# Altium schematic sheet Micromouse.SchDoc
size 594 x 420 mm; SheetNumber: 1; SheetTotal: 1
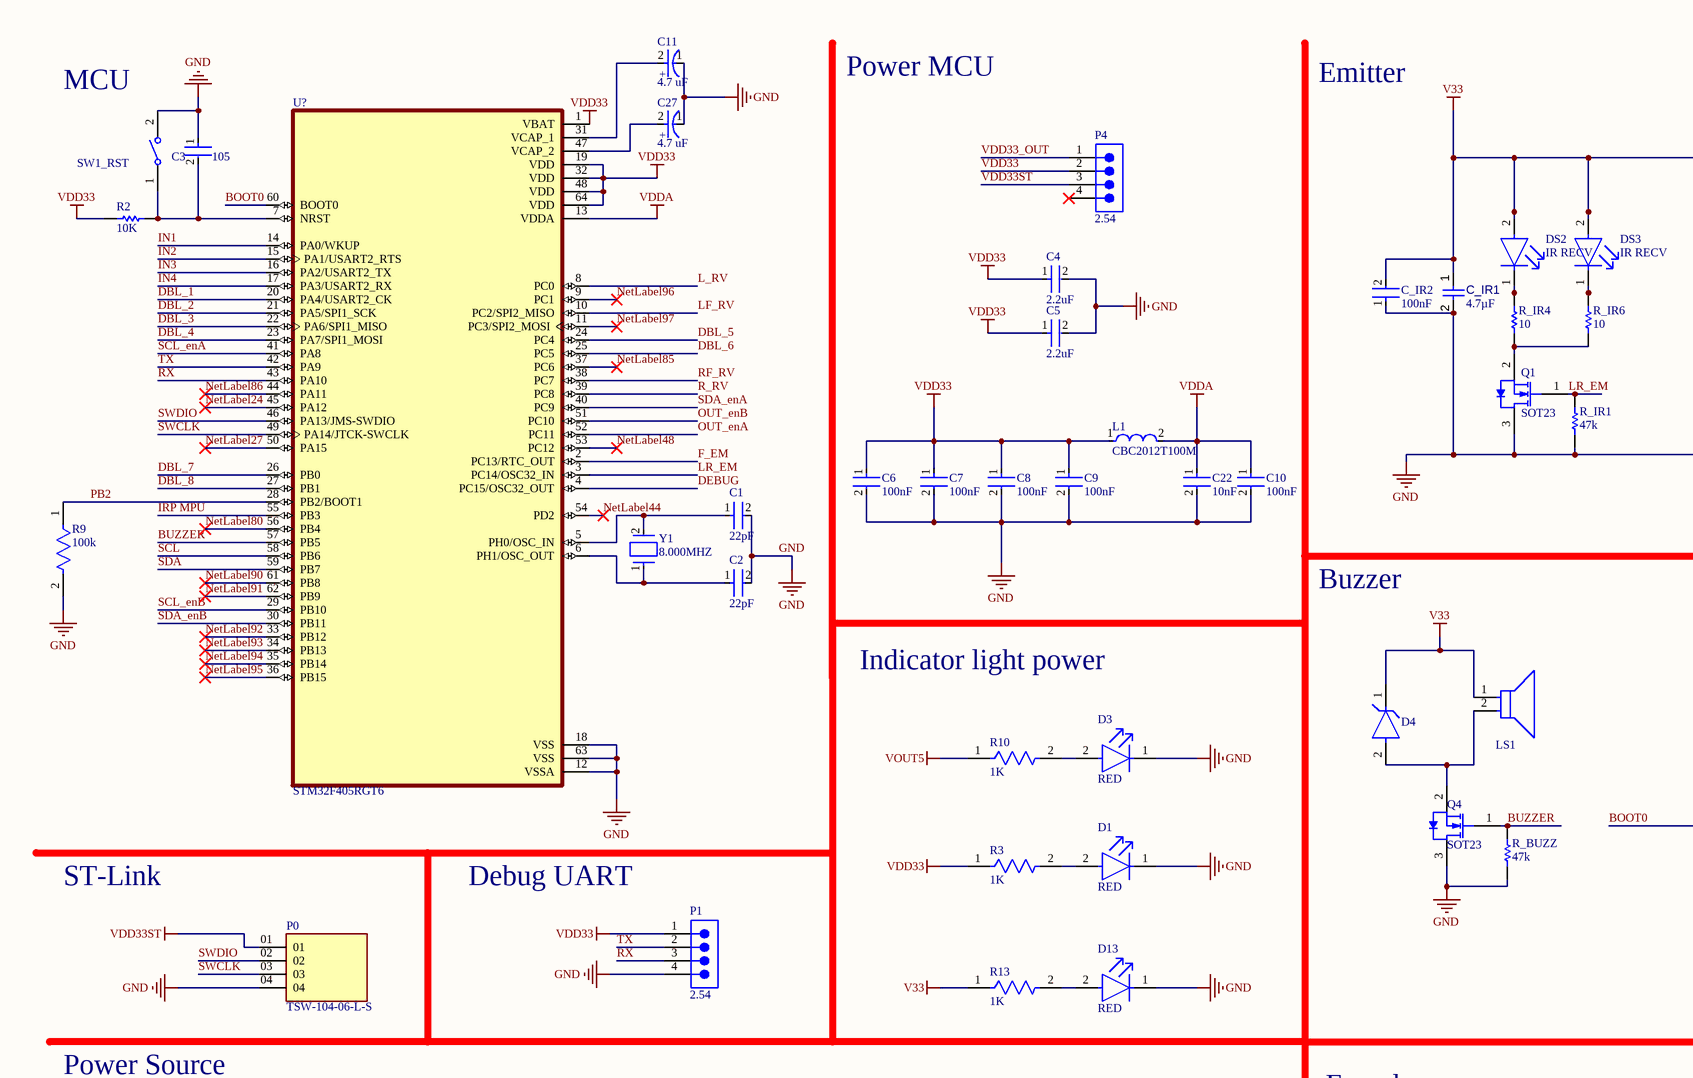
[diagram p0: Micromouse.SchDoc, top left]
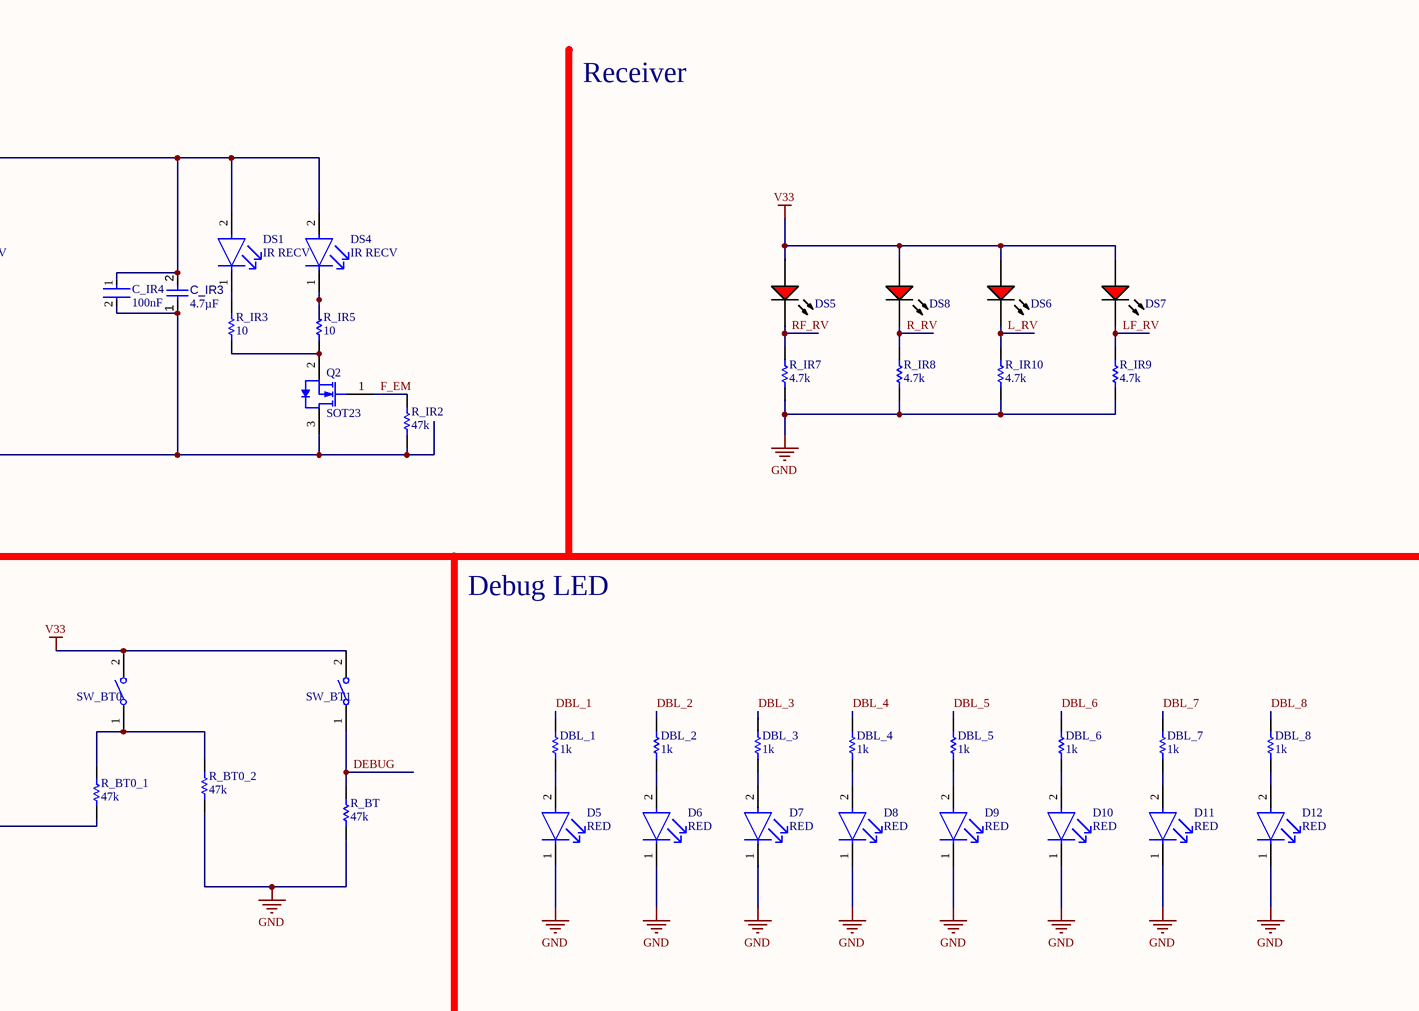
[diagram p1: Micromouse.SchDoc, top right]
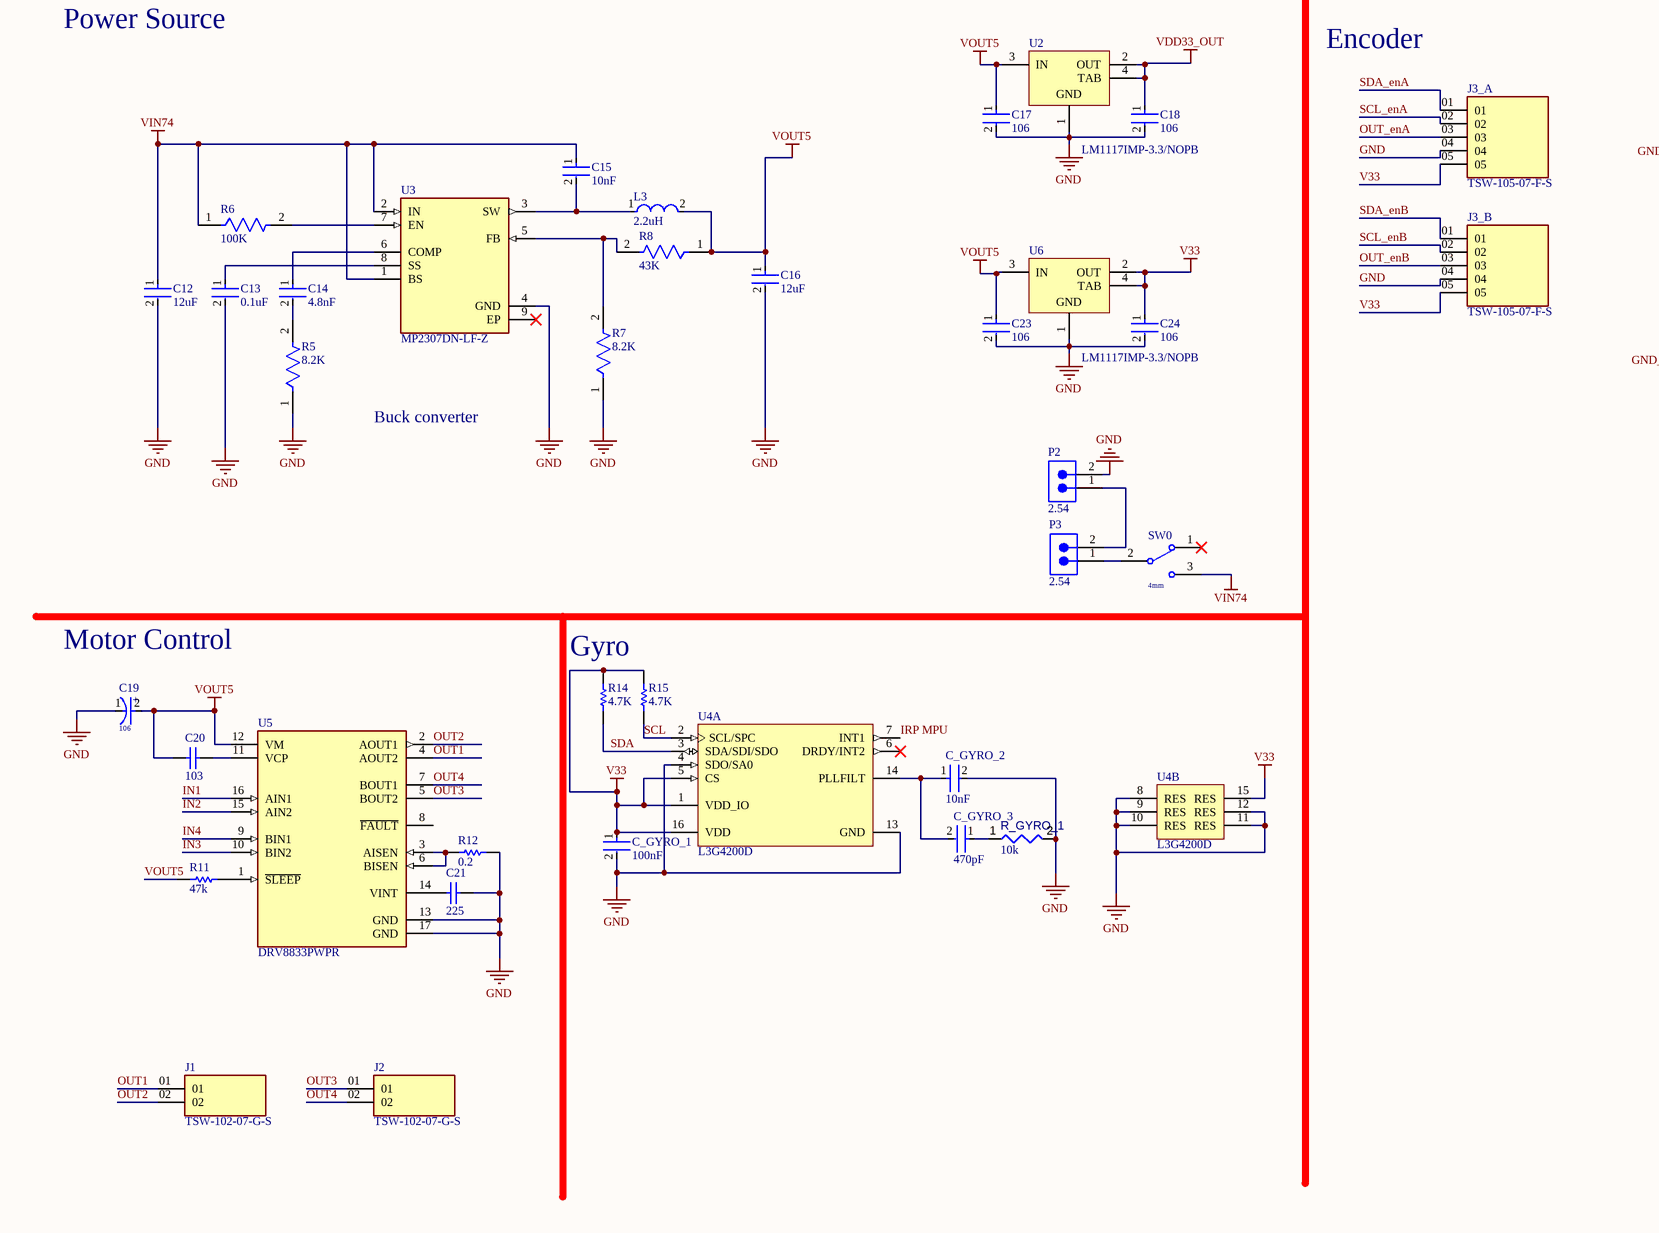
[diagram p2: Micromouse.SchDoc, bottom left]
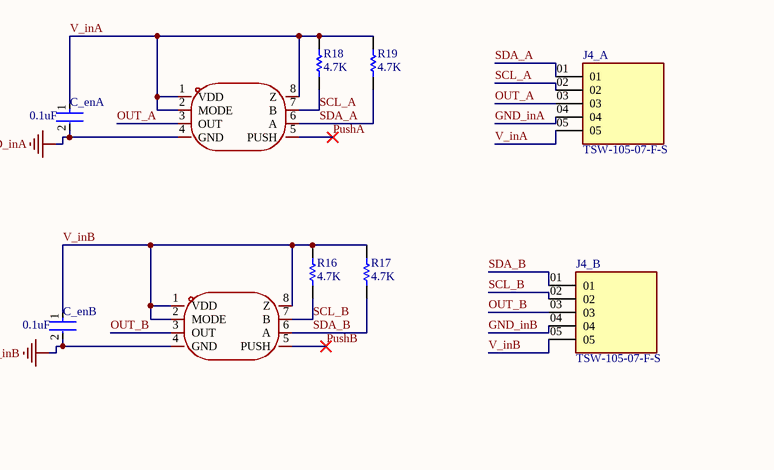
[diagram p3: Micromouse.SchDoc, bottom right]

## Parts
C1  22pF  [FP-CL32-IPC_B]
C2  22pF  [FP-CL32-IPC_B]
C3  105  [FP-CL21-IPC_B]
C4  2.2uF  [FP-CL21-IPC_B]
C5  2.2uF  [FP-CL21-IPC_B]
C6  100nF  [FP-CL10-IPC_C]
C7  100nF  [FP-CL10-IPC_C]
C8  100nF  [FP-CL10-IPC_C]
C9  100nF  [FP-CL10-IPC_C]
C10  100nF  [FP-CL10-IPC_C]
C11  4.7 uF  [FP-TAJA-MFG]
C12  12uF  [FP-C1206C-EB-MFG]
C13  0.1uF  [FP-C1206C-EB-MFG]
C14  4.8nF  [FP-C1206C-EB-MFG]
C15  10nF  [FP-C1206C-EB-MFG]
C16  12uF  [FP-C1206C-EB-MFG]
C17  106  [FP-GRT31C-0_2-IPC_A]
C18  106  [FP-GRT31C-0_2-IPC_A]
C19  106  [FP-T491C-MFG]
C20  103  [CAPC2013X88X50LL20T25]
C21  225  [CAPC3216X180X50LL20T25]
C22  10nF  [FP-CL10-IPC_C]
C23  106  [FP-GRT31C-0_2-IPC_A]
C24  106  [FP-GRT31C-0_2-IPC_A]
C27  4.7 uF  [FP-TAJA-MFG]
C_enA  0.1uF  [FP-C1206C-EB-MFG]
C_enB  0.1uF  [FP-C1206C-EB-MFG]
C_GYRO_1  100nF  [FP-CL10-IPC_C]
C_GYRO_2  10nF  [FP-C0805C-DN-MFG]
C_GYRO_3  470pF  [FP-C0805C-DN-MFG]
C_IR1  value 4.7µF  [CAPC0805(2012)145_L]  (hidden comment: Capacitor 4.7µF +/-40% 25V 0805)
C_IR2  100nF  [FP-CL10-IPC_C]
C_IR3  value 4.7µF  [CAPC0805(2012)145_L]  (hidden comment: Capacitor 4.7µF +/-40% 25V 0805)
C_IR4  100nF  [FP-CL10-IPC_C]
D1  RED  [FP-LTST-C190GKT-MFG]
D3  RED  [FP-LTST-C190GKT-MFG]
D4  MMSZ5232B  [FP-MA02A-MFG]  (value not drawn)
D5  RED  [FP-LTST-C190GKT-MFG]
D6  RED  [FP-LTST-C190GKT-MFG]
D7  RED  [FP-LTST-C190GKT-MFG]
D8  RED  [FP-LTST-C190GKT-MFG]
D9  RED  [FP-LTST-C190GKT-MFG]
D10  RED  [FP-LTST-C190GKT-MFG]
D11  RED  [FP-LTST-C190GKT-MFG]
D12  RED  [FP-LTST-C190GKT-MFG]
D13  RED  [FP-LTST-C190GKT-MFG]
DBL_1  value 1k  [RESC2013X70X40ML20T20]  (hidden comment: Resistor 1k +/-1% 0805 125 mW)
DBL_2  value 1k  [RESC2013X70X40ML20T20]  (hidden comment: Resistor 1k +/-1% 0805 125 mW)
DBL_3  value 1k  [RESC2013X70X40ML20T20]  (hidden comment: Resistor 1k +/-1% 0805 125 mW)
DBL_4  value 1k  [RESC2013X70X40ML20T20]  (hidden comment: Resistor 1k +/-1% 0805 125 mW)
DBL_5  value 1k  [RESC2013X70X40ML20T20]  (hidden comment: Resistor 1k +/-1% 0805 125 mW)
DBL_6  value 1k  [RESC2013X70X40ML20T20]  (hidden comment: Resistor 1k +/-1% 0805 125 mW)
DBL_7  value 1k  [RESC2013X70X40ML20T20]  (hidden comment: Resistor 1k +/-1% 0805 125 mW)
DBL_8  value 1k  [RESC2013X70X40ML20T20]  (hidden comment: Resistor 1k +/-1% 0805 125 mW)
DS1  IR RECV  [FP-6_544-5258_09-4-MFG]
DS2  IR RECV  [FP-6_544-5258_09-4-MFG]
DS3  IR RECV  [FP-6_544-5258_09-4-MFG]
DS4  IR RECV  [FP-6_544-5258_09-4-MFG]
DS5  UR502DC  [CGX-UR502DC]  (value not drawn)
DS6  UR502DC  [CGX-UR502DC]  (value not drawn)
DS7  UR502DC  [CGX-UR502DC]  (value not drawn)
DS8  UR502DC  [CGX-UR502DC]  (value not drawn)
J1  TSW-102-07-G-S  [SAMTEC_TSW-102-07-G-S]
J2  TSW-102-07-G-S  [SAMTEC_TSW-102-07-G-S]
J3_A  TSW-105-07-F-S  [SAMTEC_TSW-105-07-F-S]
J3_B  TSW-105-07-F-S  [SAMTEC_TSW-105-07-F-S]
J4_A  TSW-105-07-F-S  [SAMTEC_TSW-105-07-F-S]
J4_B  TSW-105-07-F-S  [SAMTEC_TSW-105-07-F-S]
L1  CBC2012T100M  [FP-CB2012-IPC_C]
L3  2.2uH  [FP-LB2518-1_8-0_2-IPC_A]
LS1  MCKPX-G1203A-K4056  [FP-MCKPX-G1203A-K4056-MFG]  (value not drawn)
P0  TSW-104-06-L-S  [SAMTEC_TSW-104-06-L-S]
P1  2.54  [61300411121]
P2  2.54  [61300211121]
P3  2.54  [61300211121]
P4  2.54  [61300411121]
Q1  SOT23  [FAIR-SSOT3L-3_V]
Q2  SOT23  [FAIR-SSOT3L-3_V]
Q4  SOT23  [FAIR-SSOT3L-3_V]
R2  10K  [RESC1206(3216)_M]
R3  1K  [FP-RC1005-IPC_A]
R5  8.2K  [FP-CRCW0805-e3-IPC_B]
R6  100K  [FP-CRCW0805-e3-IPC_B]
R7  8.2K  [FP-CRCW0805-e3-IPC_B]
R8  43K  [FP-CRCW0805-e3-IPC_B]
R9  100k  [FP-RC3216-IPC_C]
R10  1K  [FP-RC1005-IPC_A]
R11  47k  [RESC3216X60X45LL10T20]
R12  0.2  [RESC3216X89X51ML25T25]
R13  1K  [FP-RC1005-IPC_A]
R14  4.7K  [RESC3216X60X45LL10T20]
R15  4.7K  [RESC3216X60X45LL10T20]
R16  4.7K  [RESC3216X60X45LL10T20]
R17  4.7K  [RESC3216X60X45LL10T20]
R18  4.7K  [RESC3216X60X45LL10T20]
R19  4.7K  [RESC3216X60X45LL10T20]
R_BT  47k  [RESC2013X60X35NL10T20]
R_BT0_1  47k  [RESC2013X60X35NL10T20]
R_BT0_2  47k  [RESC2013X60X35NL10T20]
R_BUZZ  47k  [RESC2013X60X35NL10T20]
R_GYRO_1  value 10k  [RESC2013X50X35ML15T15]  (hidden comment: Resistor 10k +/-1% 0805 125 mW)
R_IR1  47k  [RESC2013X60X35NL10T20]
R_IR2  47k  [RESC2013X60X35NL10T20]
R_IR3  10  [RESC2013X50X30NL20T20]
R_IR4  10  [RESC2013X50X30NL20T20]
R_IR5  10  [RESC2013X50X30NL20T20]
R_IR6  10  [RESC2013X50X30NL20T20]
R_IR7  4.7k  [YAGO-RC0805_M]
R_IR8  4.7k  [YAGO-RC0805_M]
R_IR9  4.7k  [YAGO-RC0805_M]
R_IR10  4.7k  [YAGO-RC0805_M]
SW0  4mm  [ESWI-EG1218_V]
SW1_RST  (no value)  [TECO-FSMSMTR_V]
SW_BT0  (no value)  [TECO-FSMSMTR_V]
SW_BT1  (no value)  [TECO-FSMSMTR_V]
U2  LM1117IMP-3.3/NOPB  [DCY0004A_N]
U3  MP2307DN-LF-Z  [SOIC127P600X170-9N]
U4  L3G4200D  [STM-LGA16-4X4X1.1]  (parts A,B of 2)
U5  DRV8833PWPR  [FP-PWP0016C-IPC_B]
U6  LM1117IMP-3.3/NOPB  [DCY0004A_N]
U?  STM32F405RGT6  [QFP50P1200X1200X160-64N]
U_enA  MT6701CT-STD  [SOP-8_L4.9-W3.9-P1.27-LS6.0-BL]  (value not drawn)
U_enB  MT6701CT-STD  [SOP-8_L4.9-W3.9-P1.27-LS6.0-BL]  (value not drawn)
Y1  8.000MHZ  [FP-ABLS-MFG]

## Nets
GND: C1.2 C2.2 C3.1 C4.2 C5.2 C6.2 C7.2 C8.2 C9.2 C10.2 C11.1(C) C12.2 C13.2 C16.2 C17.2 C18.2 C19.1(C) C21.2 C22.2 C23.2 C24.2 C27.1(C) C_GYRO_1.2 C_GYRO_2.2 C_IR1.2 C_IR2.1 C_IR3.1 C_IR4.2 D1.1(C) D3.1(C) D5.1(C) D6.1(C) D7.1(C) D8.1(C) D9.1(C) D10.1(C) D11.1(C) D12.1(C) D13.1(C) J3_A.04 J3_B.04 P0.04 P1.4 P2.2 Q1.3(D) Q2.3(D) Q4.3(D) R5.1 R7.1 R9.2 R12.2 R_BT.1 R_BT0_2.1 R_BUZZ.1 R_GYRO_1.2 R_IR1.1 R_IR2.1 R_IR7.1 R_IR8.1 R_IR9.1 R_IR10.1 SW1_RST.2 U2.1(GND) U3.4(GND) U4.4(SDO/SA0) U4.8(RES) U4.9(RES) U4.10(RES) U4.11(RES) U4.12(RES) U4.13(GND) U5.13(GND) U5.17(GND) U6.1(GND) U?.12(VSSA) U?.18(VSS) U?.63(VSS)
GND_inA: C_enA.2 J4_A.04 U_enA.4(GND)
GND_inB: C_enB.2 J4_B.04 U_enB.4(GND)
V33: C24.1 C_GYRO_1.1 C_IR1.1 C_IR2.2 C_IR3.2 C_IR4.1 D4.1(C) DS1.2(A) DS2.2(A) DS3.2(A) DS4.2(A) DS5.1(A) DS6.1(A) DS7.1(A) DS8.1(A) J3_A.05 J3_B.05 LS1.1(C) R13.1 R14.2 R15.2 SW_BT0.2 SW_BT1.2 U4.1(VDD_IO) U4.5(CS) U4.15(RES) U4.16(VDD) U6.2(OUT) U6.4(TAB)
VDD33: C4.1 C5.1 C6.1 C7.1 C8.1 C9.1 L1.1 P1.1 P4.2 R2.1 R3.1 U?.1(VBAT) U?.19(VDD) U?.32(VDD) U?.48(VDD) U?.64(VDD)
VDD33_OUT: C18.1 P4.1 U2.2(OUT) U2.4(TAB)
VDD33ST: P0.01 P4.3
VDDA: C10.1 C22.1 L1.2 U?.13(VDDA)
VIN74: C12.1 C15.1 R6.1 SW0.3 U3.1(BS) U3.2(IN)
VOUT5: C16.1 C17.1 C19.2(A) C20.1 C23.1 L3.2 R8.1 R10.1 R11.1 U2.3(IN) U5.12(VM) U6.3(IN)
BOOT0: R_BT0_1.1 U?.60(BOOT0)
BUZZER: Q4.1(G) R_BUZZ.2 U?.57(PB5)
DBL_1: DBL_1.2 U?.20(PA4/USART2_CK)
DBL_2: DBL_2.2 U?.21(PA5/SPI1_SCK)
DBL_3: DBL_3.2 U?.22(PA6/SPI1_MISO)
DBL_4: DBL_4.2 U?.23(PA7/SPI1_MOSI)
DBL_5: DBL_5.2 U?.24(PC4)
DBL_6: DBL_6.2 U?.25(PC5)
DBL_7: DBL_7.2 U?.26(PB0)
DBL_8: DBL_8.2 U?.27(PB1)
DEBUG: R_BT.2 SW_BT1.1 U?.4(PC15/OSC32_OUT)
F_EM: Q2.1(G) R_IR2.2 U?.2(PC13/RTC_OUT)
IN1: U5.16(AIN1) U?.14(PA0/WKUP)
IN2: U5.15(AIN2) U?.15(PA1/USART2_RTS)
IN3: U5.10(BIN2) U?.16(PA2/USART2_TX)
IN4: U5.9(BIN1) U?.17(PA3/USART2_RX)
IRP MPU: U4.7(INT1) U?.55(PB3)
L_RV: DS6.2(K) R_IR10.2 U?.8(PC0)
LF_RV: DS7.2(K) R_IR9.2 U?.10(PC2/SPI2_MISO)
LR_EM: Q1.1(G) R_IR1.2 U?.3(PC14/OSC32_IN)
NetLabel24: U?.45(PA12)
NetLabel27: U?.50(PA15)
NetLabel44: U?.54(PD2)
NetLabel48: U?.53(PC12)
NetLabel80: U?.56(PB4)
NetLabel85: U?.37(PC6)
NetLabel86: U?.44(PA11)
NetLabel90: U?.61(PB8)
NetLabel91: U?.62(PB9)
NetLabel92: U?.33(PB12)
NetLabel93: U?.34(PB13)
NetLabel94: U?.35(PB14)
NetLabel95: U?.36(PB15)
NetLabel96: U?.9(PC1)
NetLabel97: U?.11(PC3/SPI2_MOSI)
OUT1: J1.01 U5.4(AOUT2)
OUT2: J1.02 U5.2(AOUT1)
OUT3: J2.01 U5.5(BOUT2)
OUT4: J2.02 U5.7(BOUT1)
OUT_A: J4_A.03 U_enA.3(OUT)
OUT_B: J4_B.03 U_enB.3(OUT)
OUT_enA: J3_A.03 U?.52(PC11)
OUT_enB: J3_B.03 U?.51(PC10)
PB2: R9.1 U?.28(PB2/BOOT1)
PushA: U_enA.5(PUSH)
PushB: U_enB.5(PUSH)
R_RV: DS8.2(K) R_IR8.2 U?.39(PC8)
RF_RV: DS5.2(K) R_IR7.2 U?.38(PC7)
RX: P1.3 U?.43(PA10)
SCL: R15.1 U4.2(SCL/SPC) U?.58(PB6)
SCL_A: J4_A.02 R18.1 U_enA.7(B)
SCL_B: J4_B.02 R16.1 U_enB.7(B)
SCL_enA: J3_A.02 U?.41(PA8)
SCL_enB: J3_B.02 U?.29(PB10)
SDA: R14.1 U4.3(SDA/SDI/SDO) U?.59(PB7)
SDA_A: J4_A.01 R19.1 U_enA.6(A)
SDA_B: J4_B.01 R17.1 U_enB.6(A)
SDA_enA: J3_A.01 U?.40(PC9)
SDA_enB: J3_B.01 U?.30(PB11)
SWCLK: P0.03 U?.49(PA14/JTCK-SWCLK)
SWDIO: P0.02 U?.46(PA13/JMS-SWDIO)
TX: P1.2 U?.42(PA9)
V_inA: C_enA.1 J4_A.05 R18.2 R19.2 U_enA.1(VDD) U_enA.2(MODE) U_enA.8(Z)
V_inB: C_enB.1 J4_B.05 R16.2 R17.2 U_enB.1(VDD) U_enB.2(MODE) U_enB.8(Z)
NetC1_1: C1.1 U?.5(PH0/OSC_IN) Y1.2
NetC2_1: C2.1 U?.6(PH1/OSC_OUT) Y1.1
NetC3_2: C3.2 R2.2 SW1_RST.1 U?.7(NRST)
NetC11_2: C11.2(A) U?.31(VCAP_1)
NetC13_1: C13.1 U3.8(SS)
NetC14_1: C14.1 U3.6(COMP)
NetC14_2: C14.2 R5.2
NetC15_2: C15.2 L3.1 U3.3(SW)
NetC20_2: C20.2 U5.11(VCP)
NetC21_1: C21.1 U5.14(VINT)
NetC27_2: C27.2(A) U?.47(VCAP_2)
NetC_GYRO_2_1: C_GYRO_2.1 C_GYRO_3.2 U4.14(PLLFILT)
NetC_GYRO_3_1: C_GYRO_3.1 R_GYRO_1.1
NetD1_2: D1.2(A) R3.2
NetD3_2: D3.2(A) R10.2
NetD4_2: D4.2(A) LS1.2(A) Q4.2(S)
NetD5_2: D5.2(A) DBL_1.1
NetD6_2: D6.2(A) DBL_2.1
NetD7_2: D7.2(A) DBL_3.1
NetD8_2: D8.2(A) DBL_4.1
NetD9_2: D9.2(A) DBL_5.1
NetD10_2: D10.2(A) DBL_6.1
NetD11_2: D11.2(A) DBL_7.1
NetD12_2: D12.2(A) DBL_8.1
NetD13_2: D13.2(A) R13.2
NetDS1_1: DS1.1(C) R_IR3.2
NetDS2_1: DS2.1(C) R_IR4.2
NetDS3_1: DS3.1(C) R_IR6.2
NetDS4_1: DS4.1(C) R_IR5.2
NetP2_1: P2.1 P3.2
NetP3_1: P3.1 SW0.2(COM)
NetQ1_2: Q1.2(S) R_IR4.1 R_IR6.1
NetQ2_2: Q2.2(S) R_IR3.1 R_IR5.1
NetR6_2: R6.2 U3.7(EN)
NetR7_2: R7.2 R8.2 U3.5(FB)
NetR11_2: R11.2 U5.1(~{SLEEP})
NetR12_1: R12.1 U5.3(AISEN) U5.6(BISEN)
NetR_BT0_1_2: R_BT0_1.2 R_BT0_2.2 SW_BT0.1

Not connected (* = marked no-connect by the designer): P4 4*; SW0 1*; U3 9(EP)*; U4 6(DRDY/INT2)*; U5 8(~{FAULT})

## Notes on the sheet
- MCU
- Power MCU
- Emitter
- Receiver
- Buzzer
- Debug LED
- Indicator light power
- ST-Link
- Debug UART
- Power Source
- Encoder
- Buck converter
- Motor Control
- Gyro
- (in symbol CMP-03017-000001-1) +
- (in symbol CMP-04424-000323-2) +

## Library data of the parts
C1 C2 = CMP-13271-001877-1: Cap Ceramic 22uF 6.3V X7R ±20% SMD 1210 +125°C Embossed T/R; Radiation Hardening: No; Case Code (Metric): 3225; Tolerance: 20%; Dielectric: X7R; Voltage Rating (DC): 6.3V; Package Quantity: 1; Lead Free: Lead Free; Max Operating Temperature: 125°C; Height: 2.5mm; Thickness: 0.106inch; Case Code (Imperial): 1210; Voltage Rating: 6.3V; Packaging: Tape and Reel; Capacitance: 22uF; Length: 3.2mm; Min Operating Temperature: -55°C; Depth: 2.5mm; Case/Package: 1210; Width: 0.098inch; Mount: Surface Mount
C3 = CMP-13271-002018-1: CL21 Series 0805 1uF 25V -20/+80% Tolerance Y5V Multilayer Ceramic Chip Capacitor; Tolerance: 80%; Voltage Rating: 25V; Voltage Rating (DC): 25V; Capacitance: 1uF; Thickness: 0.053inch; Radiation Hardening: No; Width: 0.049inch; Height: 1.25mm; Max Operating Temperature: 85°C; Mount: Surface Mount; Package Quantity: 10000; Depth: 1.25mm; Min Operating Temperature: -30°C; Packaging: Tape and Reel; Case/Package: 0805; Length: 2mm; Dielectric: Y5V
C4 C5 = CMP-13271-004097-1: CL21 Series 0805 2.2uF 16V -20/+80% Tolerance Y5V Multilayer Ceramic Chip Capacitor; Tolerance: 80%; Voltage: 10V; Packaging: Tape and Reel; Package Quantity: 10000; Length: 2mm; Depth: 1.25mm; Dielectric: Y5V; Width: 0.049inch; Voltage Rating (DC): 16V; Lead Free: Lead Free; Height: 1.25mm; Mount: Surface Mount; Min Operating Temperature: -30°C; Radiation Hardening: No; Case/Package: 0805; Thickness: 0.053inch; Voltage Rating: 16V; Max Operating Temperature: 85°C; Capacitance: 2.2uF
C6-C10 C22 C_GYRO_1 C_IR2 C_IR4 = CMP-13271-001423-1: Cap Ceramic 100nF 25V X7R ±10% Pad SMD 0603 +125°C T/R; Depth: 0.8mm; Tolerance: 10%; Case Code (Imperial): 0603; Max Operating Temperature: 125°C; Min Operating Temperature: -55°C; Dielectric: X7R; Width: 0.031inch; Thickness: 0.035inch; Height: 0.8mm; Length: 1.6mm; Mount: Surface Mount; Capacitance: 100nF; Voltage Rating: 25V; Case Code (Metric): 1608; Case/Package: 0603; Radiation Hardening: No; Packaging: Tape and Reel
C11 C27 = CMP-04424-000323-2: 4.7uF 20V  ±10% 4Ω 3216(mm)  SMD Tantalum Capacitor; NexarPartId: 39985789; Q Factor: 6; Ripple Current: 137mA; Life (Hours): 2000hours; Dissipation Factor: 6%; Capacitance: 4.7µF; Leakage Current: 900nA; Polarity: Polar; Case Code (Imperial): 1206; Min Operating Temperature: -55°C; Length: 3.2mm; Lead Free: Lead Free; Width: 1.6mm; REACH SVHC: No SVHC; ESR (Equivalent Series Resistance): 4Ω; Lead Pitch: 1.1mm; RoHS: Compliant; Voltage Rating: 20V; Packaging: Cut Tape (CT); Height: 1.6mm; Dielectric Material: Tantalum; Voltage Rating (DC): 20V; Number of Pins: 2; Max Operating Temperature: 125°C; Height - Seated (Max): 1.8034mm; Schedule B: 8532210050; Lifecycle Status: Production; Depth: 1.6mm; Radiation Hardening: No; Case/Package: 1206; Features: General Purpose; Case Code (Metric): 3216; Tolerance: 10%; Termination: SMD/SMT; Voltage: 20V; Mount: PCB, Surface Mount
C12-C16 = CMP-1037-00646-2: C1206 10 pF C0G 5.00% 50 V; Manufacturer Part Number: C1206C100J5GAC; Manufacturer: KEMET; Material: Ceramic; Automotive Grade: Grade 0; Voltage Rating: 50 V; Value: 10 pF; Temperature Coefficient: 15%; Tolerance: 0.05; Temperature: -55°C to +150°C; ComponentLink2URL: https://content.kemet.com/datasheets/KEM_C1007_X8R_ULTRA_150C_SMD.pdf; RoHS: TRUE; Lead Free: Yes; Category: Cap; Package: C1206C-EB; Device Class L2: Capacitors; Device Class L1: Passive Components; ComponentLink2Description: Datasheet; Ipc Land Pattern Name: CAPC320160X78; Device Class L3: Ceramic Capacitors; Temperature Characteristic: C0G; Octopart: https://octopart.com/c1206c100j5gac-kemet-1357555; Automotive: Yes; Height: 0.88mm; Temperature Range High: +150°C; Mouser Description: Multilayer Ceramic Capacitors MLCC - SMD/SMT 50volts 10pF 5% C0G; Temperature Range Low: -55°C; Capacitance: 10 pF
C17 C18 C23 C24 = CMP-06035-000076-2: Multi-Layer Ceramic Capacitor 10uF 50V X5R ±10% 1206 Emboss T/R; Length: 0.126inch; Max Operating Temperature: 85°C; Width: 0.063inch; Ratings: AEC-Q200; Voltage Rating: 50V; Dielectric: X5R; Min Operating Temperature: -55°C; Case Code (Imperial): 1206; Capacitance: 10uF; Case Code (Metric): 3216; Thickness: 0.071inch; Tolerance: 10%; Mount: Surface Mount; Case/Package: 1206; Packaging: Cut Tape; Voltage Rating (DC): 50V
C19 = CMP-03017-000001-1: CAP TANT 10UF 10% 25V 2312; Manufacturer Part Number: T491C106K025AT; Manufacturer: Kemet; Material: Tantalum; Standoff Height: 0mm; Life: 2000Hours; Dissipation Factor: 6%; Esr: 1.5Ω; Ripple Current: 271mA; Leakage Current: 2.5uA; Digikey Description: CAP TANT 10UF 10% 25V 2312; Voltage Rating: 25V; Device Class L3: Tantalum Capacitors; ComponentLink2Description: Datasheet; Tolerance: 10%; Device Class L2: Capacitors; Temperature: -55°C to +125°C; Octopart: https://octopart.com/t491c106k025at-kemet-126002; Automotive: No; Height: 2.8mm; Package: T491C; Temperature Range Low: -55°C; Lead Free: Yes; Capacitance: 10uF; Category: Cap; Mouser Description: Tantalum Capacitors - Solid SMD 25V 10uF 10% C; Temperature Range High: +125°C; Value: 10uF; Device Class L1: Passive Components; ComponentLink2URL: https://content.kemet.com/datasheets/KEM_T2005_T491.pdf; RoHS: TRUE
C20 = CMP-2007-00266-1: Manufacturer: Kemet; Part Number: C0805C103K5RACTU
C21 = CMP-1037-04831-2: Chip Capacitor, 2.2 uF, +/- 10%, 50 V, -55 to 125 degC, 1206 (3216 Metric), RoHS, Tape and Reel; Manufacturer: Kemet; Case Width: 1.6mm; Capacitance - nF: 2200nF; Capacitance: 2.2uF; Class: Class1; Type: SMDMLCCX7R6.3-250VDCCommericalGrade; Voltage Rating: 50V; Case Length: 3.2mm; Dielectric: X7R; Temperature Coefficient / Code: +/-15%; Product Category: MultilayerCeramicCapacitorsMLCC-SMD/SMT; Package Description: 2-Pin Surface Mount Device, Body 3.2 x 1.6 mm; Minimum Operating Temperature: -55C; RoHS: Details; Package / Case: 1206(3216metric); Packaging: Reel; Case Code - mm: 3216; Datasheet Version: 02/2016; Tolerance: 10%; Series: C1206C; Dimensions: 1.6mmWx3.2mmLx1.6mmH; Case Height: 1.6mm; Brand: Kemet; Mounting Technology: SurfaceMount; Manufacturer URL: http://www.kemet.com/; Voltage Rating DC: 50V; Datasheet URL: http://www.kemet.com/docfinder?Partnumber=C1206C225K5RACTU; Maximum Operating Temperature: +125C; Case Code - in: 1206; Package Reference: 1206; Termination Style: SMD/SMT; Operating Temperature Range: -55Cto+125C; Product: GeneralTypeMLCCs; Factory Pack Quantity: 2000
C_enA C_enB = CMP-1037-00646-2: C1206 10 pF C0G 5.00% 50 V; Manufacturer Part Number: C1206C100J5GAC; Manufacturer: KEMET; Automotive Grade: Grade 0; Voltage Rating: 50 V; Value: 10 pF; Temperature Coefficient: 15%; Tolerance: 0.05; Temperature: -55°C to +150°C; ComponentLink2URL: https://content.kemet.com/datasheets/KEM_C1007_X8R_ULTRA_150C_SMD.pdf; RoHS: TRUE; Lead Free: Yes; Category: Cap; Package: C1206C-EB; Device Class L2: Capacitors; Device Class L1: Passive Components; ComponentLink2Description: Datasheet; Material: Ceramic; Ipc Land Pattern Name: CAPC320160X78; Device Class L3: Ceramic Capacitors; Temperature Characteristic: C0G; Octopart: https://octopart.com/c1206c100j5gac-kemet-1357555; Automotive: Yes; Height: 0.88mm; Temperature Range High: +150°C; Mouser Description: Multilayer Ceramic Capacitors MLCC - SMD/SMT 50volts 10pF 5% C0G; Temperature Range Low: -55°C; Capacitance: 10 pF
C_GYRO_2 = CMP-2007-00259-2: CAP CER 10000PF 200V X7R 0805; Manufacturer Part Number: C0805C103K2RACTU; Manufacturer: KEMET; Temperature Coefficient: 30ppm/°C; Capacitance: 10,000 pF; Tolerance: 0.1; Value: 10,000 pF; Device Class L2: Capacitors; Voltage Rating: 200 V; Temperature Range High: +125°C; ComponentLink2Description: Datasheet; Height: 0.88mm; Octopart: https://octopart.com/c0805c103k2ractu-kemet-9138347; Material: Ceramic; ComponentLink2URL: https://content.kemet.com/datasheets/KEM_C1003_C0G_SMD.pdf; Category: Cap; Temperature: -55°C to +125°C; Temperature Range Low: -55°C; Digikey Description: CAP CER 10000PF 200V X7R 0805; Temperature Characteristic: X7R; Automotive: No; Device Class L3: Ceramic Capacitors; Mouser Description: KEMET - C0805C103K2RACTU - CAP, MLCC, X7R, 10NF, 200V, 0805; RoHS: TRUE; Device Class L1: Passive Components; Lead Free: Yes; Package: C0805C-DN; Ipc Land Pattern Name: CAPC200125X78
C_GYRO_3 = CMP-03020-010032-1: CAP CER 470PF 50V X7R 0805; Manufacturer Part Number: C0805C471K5RACTU; Manufacturer: KEMET; Tolerance: 0.1; Temperature Coefficient: 30ppm/°C; RoHS: TRUE; Temperature Range Low: -55°C; Ipc Land Pattern Name: CAPC200125X78; Mouser Description: Ceramic Capacitor, 470Pf, 50V, X7R, 10%, 0805, Full Reel; Device Class L3: Ceramic Capacitors; Category: Cap; Octopart: https://octopart.com/c0805c471k5ractu-kemet-139563; Height: 0.88mm; Temperature Characteristic: X7R; Temperature: -55°C to +125°C; Temperature Range High: +125°C; Voltage Rating: 50 V; Device Class L1: Passive Components; Material: Ceramic; Package: C0805C-DN; ComponentLink2URL: https://content.kemet.com/datasheets/KEM_C1003_C0G_SMD.pdf; Automotive: No; ComponentLink2Description: Datasheet; Digikey Description: CAP CER 470PF 50V X7R 0805; Value: 470 pF; Device Class L2: Capacitors; Lead Free: Yes; Capacitance: 470 pF
C_IR1 C_IR3 = CMP-001-00080-4: Chip Capacitor, 4.7µF +/-40%, 25V, 0805, Thickness 1.45 mm; Tolerance: 20%; Voltage Rating: 25V; Min Operating Temperature: -55°C; Max Operating Temperature: 85°C; Pins: 2; Mounting Technology: SMT; Case/Package: 0805
D1 D3 D5-D13 = CMP-22017-000005-2: LED GREEN CLEAR CHIP SMD; Dominant Wavelength: 569nm; Reverse Voltage: 5V; Lens Color: Colorless; Viewing Angle: 130°; Voltage: 2V; Forward Current: 30mA; Power Dissipation: 100mW; Luminous Intensity: 6mcd; Number of LEDs: 1; Forward Voltage: 2.1V; Wavelength: 565nm; Test Current: 10mA; Min Operating Temperature: -55°C; Lens Style: Clear; Mount: Surface Mount; Width: 0.8mm; Packaging: Tape and Reel; Lens Transparency: Clear; Case Code (Metric): 1608; Depth: 0.8mm; Case Code (Imperial): 0603; Case/Package: 0603; Number of Pins: 2; Max Operating Temperature: 85°C; Lead Free: Lead Free; Number of Elements: 1; Length: 1.6mm; Height: 0.8mm; Package Quantity: 1; Power Rating: 100mW; Radiation Hardening: No; Illumination Color: Green; Color: Green
D4 = CMP-00278-11829623-1: MMSZ5232B MMSZ523 Series 500 mW 5.6 V 10 mA SMT Half-Watt Zener Diode SOD-123; ESD Protection: No; Peak Reverse Current: 5µA; Max Junction Temperature (Tj): 150°C; Forward Voltage: 900mV; Power Rating: 500mW; Reverse Voltage: 3V; Tolerance: 5%; Zener Voltage: 5.6V; Element Configuration: Single; Impedance: 11Ω; Test Current: 20mA; Height: 1.28mm; NexarPartId: 11829623; Radiation Hardening: No; Weight: 30mg; Min Operating Temperature: -55°C; Voltage Tolerance: 5%; Max Operating Temperature: 150°C; Voltage Rating (DC): 5.6V; Lead Free: Lead Free; RoHS: Compliant; Width: 1.8mm; Contact Plating: Tin; Zener Current: 20mA; Working Voltage: 5.6V; Packaging: Cut Tape; Length: 2.85mm; Max Power Dissipation: 500mW; Power Dissipation: 500mW; Max Reverse Leakage Current: 5µA; Number of Pins: 2; Mount: Surface Mount; REACH SVHC: No SVHC
DBL_1-DBL_8 = CMP-009-00010-5: Chip Resistor, 1 KOhm, +/- 1%, 0.125 W, -55 to 155 degC, 0805 (2013 Metric); Power: 125mW; Voltage Rating: 150V; Tolerance: 1%; RoHS Compliant: True; Mounting Technology: SM; Pins: 2; Case/Package: 0805; Max Operating Temperature: 155°C; Min Operating Temperature: -55°C
DS1-DS4 = CMP-00030-41223146-1: TSFF5210 TSFF5210 IR LED, 870nm, T-1 3/4 (5mm) Through Hole package; Number of Elements: 1; Power Dissipation: 180W; Viewing Angle: 20°; Power Rating: 250mW; Test Current: 100mA; Forward Voltage: 1.5V; Lens Style: Circular, Colorless, Diffused, Round; Rise Time: 15ns; Reverse Voltage: 5V; REACH SVHC: Unknown; Packaging: Bulk; Schedule B: 8541402000, 8541402000; Number of LEDs: 1; Mount: Through Hole; Depth: 5.8mm; Max Operating Temperature: 85°C; Radiation Hardening: No; Case/Package: Radial; NexarPartId: 41223146; Lead Free: Lead Free; Number of Pins: 2; Wavelength: 870nm; RoHS: Compliant; Orientation: Top View; Length: 5.8mm; Peak Wavelength: 870nm; Contact Plating: Tin; Min Operating Temperature: -40°C; Forward Current: 100mA
DS5-DS8 = CMP-007-00009-2: Red LED, 80 mW, 30 mA, -25 to 85 degC, 2-Pin THD; Manufacturer: Shenzhen CGX; Power: 80mW; Case/Package: UR502DC; RoHS Compliant: Unknown; Package Description: 2-Pin Through Hole Device, Dia 5.9 mm, Height 9.1 mm; Manufacturer URL: http://szcgx.com/; Datasheet Version: Sep-14; Package Reference: UR502DC; Datasheet URL: http://datasheet.octopart.com/UR502DC-Chengguangxing-datasheet-62330342.pdf; Mounting Technology: TH
J1 J2 = CMP-033-000000-1: MF: Samtec; Package: None; Source: TSW-102-07-G-S.SchLib; Design Item ID: TSW-102-07-G-S; Price: None; Component Type: Standard; MP: TSW-102-07-G-S; Availability: Unavailable; Value: *; Pin Count: 2
J3_A J3_B J4_A J4_B = CMP-023-000001-1: MF: Samtec; Component Type: Standard; MP: TSW-105-07-F-S; Availability: Unavailable; Package: None; Pin Count: 5; Value: *; Design Item ID: TSW-105-07-F-S; Price: None; Source: TSW-105-07-F-S.SchLib
L1 = CMP-14484-000302-1: SMD Inductors 10uH ±20% 0.34A 1.56Ω 0805; Self Resonant Frequency: 40MHz; Core Material: Ferrite; Saturation Current: 240mA; Shielding: Unshielded; Test Frequency: 2.52MHz; DC Resistance (DCR): 1.56R; Inductor Type: POWER; Current Rating: 340mA; Case Code (Metric): 2012; Max Operating Temperature: 105°C; Case Code (Imperial): 0805; Lead Free: Exempt; Height: 1.25mm; Packaging: Tape and Reel; Max DC Current: 240mA; Height - Seated (Max): 0.057inch; Tolerance: 20%; Min Operating Temperature: -40°C; RoHS Compliant: Yes; Resistor Type: Wirewound; Length: 2mm; Package Quantity: 3000; Halogen Free: Halogen Free; Series: CBC; Number of Pins: 2; REACH SVHC: No SVHC; Depth: 1.25mm; Inductance Tolerance: 20%; Mount: Surface Mount; Width: 0.049inch; Inductance: 10uH; Termination: SMD/SMT; Case/Package: 0805
L3 = CMP-14484-000513-1: SMD Inductors 2.2uH ±20% 0.48A 0.091Ω 1007; Max DC Current: 480mA; Core Material: Ferrite; DC Resistance (DCR): 70mR; Shielding: Unshielded; Self Resonant Frequency: 68MHz; Test Frequency: 7.96MHz; Lead Pitch: 1.5mm; Military Standard: Not; Length: 0.098inch; Inductance: 2.2uH; DC Current: 480mA; Case/Package: 1007; Package Quantity: 2000; Tolerance: 20%; Width: 1.8mm; Current Rating: 480mA; Series: LB; Case Code (Imperial): 1007; Resistor Type: Wirewound; Packaging: Tape and Reel; Halogen Free: Halogen Free; RoHS Compliant: Yes; Min Operating Temperature: -40°C; Termination: SMD/SMT; Mount: Surface Mount; Height - Seated (Max): 0.079inch; Lead Free: Lead Free; Depth: 2mm; Radiation Hardening: No; Max Operating Temperature: 105°C; Inductance Tolerance: 20%; Height: 1.8mm; Case Code (Metric): 2518
LS1 = CMP-12433-000001-1: MAGNETIC BUZZER AND TRANSDUCER - More Details; Manufacturer: Multicomp Pro; Operating Supply Voltage: 3V; Current: 30mA; Frequency: 2300Hz; Max Supply Voltage: 5V; Min Supply Voltage: 2V; Standoff Height: 0.5mm; ComponentLink2Description: Datasheet; ComponentLink2URL: http://www.farnell.com/datasheets/1498149.pdf?_ga=2.17855225.1157923166.1572356775-536200964.1569240579; Manufacturer Part Number: MCKPX-G1203A-K4056; Temperature Range High: +70°C; Device Class L2: Audio Products; Temperature Range Low: -20°C; Package: 0; Temperature: -20°C to +70°C; Category: Speak; Octopart: https://octopart.com/mckpx-g1203a-k4056-multicomp-12157154; RoHS: TRUE; Lead Free: Yes; Height: 9.5mm; Device Class L1: Electromechanical; Automotive: No; Device Class L3: Buzzers
P0 = CMP-009-000000-1: Pin Count: 4; MP: TSW-104-06-L-S; Source: TSW-104-06-L-S.SchLib; Design Item ID: TSW-104-06-L-S; Price: None; Value: *; Availability: Unavailable; Component Type: Standard; Package: None
P1 P4 = CMP-1502-01064-3: NexarPartId: 32855522; Operating Supply Voltage: 250V; Pitch: 2.54mm; Contact Resistance: 20mΩ; Number of Positions: 4; Current Rating: 3A; Connector Type: Male Pin; Gender: Male; Contact Plating: Gold; Height: 8.89mm; Lead Pitch: 2.54mm; Lead Free: Lead Free; Contact Mating Length: 5.9944mm; Number of Rows: 1; Termination: Solder; Packaging: Bulk; REACH SVHC: Unknown; Min Operating Temperature: -40°C; RoHS: Compliant; Number of Contacts: 4; Voltage Rating: 250V; Color: Black; Max Operating Temperature: 105°C; Contact Material: Copper; Mount: Through Hole; Orientation: Vertical; Number of Pins: 4
P2 P3 = CMP-1712-00002-6: NexarPartId: 20081794; Number of Contacts: 2; Pitch: 2.54mm; Connector Type: Male Pin; Voltage Rating: 250V; Current Rating: 3A; Gender: Male; Contact Resistance: 20mΩ; Height: 8.94mm; Lead Free: Lead Free; Number of Pins: 2; Termination: Through Hole; RoHS: Compliant; Lead Pitch: 2.54mm; REACH SVHC: No SVHC; Housing Material: PBT; Contact Mating Length: 5.9944mm; Min Operating Temperature: -40°C; Orientation: Vertical; Contact Material: Copper; Contact Gender: Male; Max Operating Temperature: 125°C; Number of Rows: 1; Number of Positions: 2; Packaging: Bulk; Contact Plating: Gold; Mount: Through Hole; Color: Black; Operating Supply Voltage: 250V
Q1 Q2 Q4 = CMP-2000-06249-1: N-Channel Specified PowerTrench(R) MOSFET, 2.5 V, 1.7 A, -55 to 150 degC, 3-Pin SSOT3L, RoHS, Tape and Reel; Manufacturer: FairchildSemiconductor; RDS-on: 0.07@4.5VOhm; Typical Fall Time: 3ns; Maximum Drain Source Voltage: 20V; Rad Hard: No; Channel Mode: Enhancement; Package Version: Rev. 3, 05/2015; Maximum Gate Source Voltage: ±8V; Typical Rise Time: 8.5ns; Typical Turn-Off Delay Time: 11ns; Maximum Continuous Drain Current: 1.7A; Channel Type: N; Typical Turn-On Delay Time: 5ns; Packaging: Tape&Reel; Mounting Technology: SurfaceMount; Mounting: SurfaceMount; Manufacturer URL: https://www.fairchildsemi.com/; Datasheet URL: https://www.fairchildsemi.com/datasheets/FD/FDN335N.pdf; Package Description: 3-Pin Small Outline Transistor, Body 2.92 x 1.4 mm, Pitch 0.95 mm; Package URL: https://www.fairchildsemi.com/package-drawings/MA/MA03B.pdf; Datasheet Version: Rev. C, 04/1999; Package Reference: SSOT3L; Package: 3SuperSOT; Operating Temperature: -55to150°C; Category: MOSFET
R2 = CMP-1014-00098-1: 10K 0.25W 5% 1206 (3216 Metric)  SMD; Value: 10000.00 Ohm; Case-Metric: 3216; Case-EIA: 1206; Power: 0.25 W; Tolerance: 5 %; Technology: SMT
R3 R10 R13 = CMP-13261-004451-1: Res Thick Film 0402 1kΩ 1% 0.063W ±100ppm/°C Molded SMD T/R; Voltage Rating (DC): 50V; Max Power Dissipation: 63mW; Resistance: 1kR; Composition: Thick Film; Lead Free: Lead Free; Max Operating Temperature: 155°C; Height: 0.016inch; Number of Terminations: 2; Features: Moisture Resistant; Min Operating Temperature: -55°C; Temperature Coefficient: 100ppm/°C; Case Code (Imperial): 0402; Radiation Hardening: No; Military Standard: Not; Depth: 0.5mm; Tolerance: 1%; Case/Package: 0402; Case Code (Metric): 1005; Packaging: Tape and Reel; Length: 1mm; Width: 0.02inch; Contact Plating: Tin
R5-R8 = CMP-02407-004732-1: RES Thick Film, 2.49Ω, 1%, 0.125W, 200ppm/°C, 0805; Voltage Rating: 150V; Resistance: 2.49R; Max Power Dissipation: 125mW; Max Operating Temperature: 155°C; Tolerance: 1%; Termination: SMD/SMT; Packaging: Tape and Reel; Height: 0.02inch; Case Code (Imperial): 0805; Radiation Hardening: No; Width: 1.25mm; Voltage Rating (DC): 150V; Number of Terminations: 2; Lead Free: Lead Free; Features: Automotive AEC-Q200; Power Rating: 125mW; Case/Package: 0805; Length: 0.079inch; Contact Plating: Tin; Composition: Thick Film; Weight: 0.000194oz; Package Quantity: 5000; Min Operating Temperature: -55°C; Case Code (Metric): 2012; Temperature Coefficient: 200ppm/°C
R9 = CMP-13261-005388-1: Res Thick Film 1206 10kΩ 5% 0.25W ±100ppm/°C Molded SMD T/R; Resistance: 10kR; Voltage Rating (DC): 200V; Max Power Dissipation: 250mW; Case Code (Metric): 3216; Radiation Hardening: No; Contact Plating: Tin; Packaging: Tape and Reel; Case Code (Imperial): 1206; Composition: Thick Film; Height: 0.026inch; Features: Moisture Resistant; Temperature Coefficient: 100ppm/°C; Tolerance: 5%; Length: 0.126inch; Min Operating Temperature: -55°C; Depth: 1.6mm; Case/Package: 1206; Number of Terminations: 2; Width: 0.063inch; Lead Free: Lead Free; Military Standard: Not; Max Operating Temperature: 155°C
R11 R14-R19 = CMP-2003-02213-1: Part Number: CRCW120647K0FKEA; Manufacturer: Vishay Dale
R12 = CMP-2003-04372-1: Manufacturer: Vishay Dale; Part Number: WSL1206R2000FEA
R_BT R_BT0_1 R_BT0_2 R_BUZZ R_IR1 R_IR2 = CMP-1659-00011-4: Chip Resistor, 47 KOhm, +/- 1%, 0.125 W, -55 to 155 degC, 0805 (2012 Metric), RoHS, Tape and Reel; Manufacturer: Yageo; Voltage Rating: 150 V; Height: 0.5 mm; ComponentLink2URL: http://www.yageo.com/documents/recent/PYu-RC_Group_51_RoHS_L_04.pdf; ComponentLink2Description: Datasheet; Package Quantity: 200; Max Operating Temperature: 155 degC; Min Operating Temperature: -55 degC; Packaging: Tape and Reel; Pins: 2; PackageReference: 0805; Mounting Technology: Surface Mount; ComponentLink1Description: Manufacturer URL; ComponentLink1URL: http://www.yageo.com/; PackageDescription: 2-Pin Surface Mounted Device, Body 2 x 1.25 mm; Length: 2 mm; REACH SVHC: No SVHC; Mount: Surface Mount; RoHSCompliant: true; DatasheetVersion: Rev. 4, 02/2016
R_GYRO_1 = CMP-009-00018-5: Chip Resistor, 10 KOhm, +/- 1%, 125 mW, -55 to 155 degC, 0805 (2012 Metric); Power: 125mW; Voltage Rating: 150V; Tolerance: 1%; Pins: 2; Min Operating Temperature: -55°C; Case/Package: 0805; Max Operating Temperature: 155°C; RoHS Compliant: True; Mounting Technology: SM
R_IR3-R_IR6 = CMP-2001-04915-1: Manufacturer: Vishay Dale; Part Number: CRCW080510R0FKEA
R_IR7-R_IR10 = CMP-1568-00001-1: General Puprose Chip Resistor, 4700 Ohm +/- 1%, 0.125 W, -55 to 155 degC, 2-Pin SMD, RoHS, Tape and Reel; PartNumber: RC0805FR-074K7L; Tolerance: +/- 1%; Power: 0.125 W; PackageDescription: 2-Pin Surface Mount Device, Body 2 x 1.25 mm; ComponentLink2URL: http://www.yageo.com/documents/recent/PYu-RC_Group_51_RoHS_L-3.pdf; Temperature Min: -55 degC; Packing: Tape and Reel; Mounting Technology: Surface Mount; ComponentLink1URL: http://www.yageo.com/NewPortal/_en/index.jsp; Resistance: 4700 Ohm; Temperature Max: 155 degC; ComponentLink2Description: Datasheet; DatasheetVersion: Rev. 3; RoHS: TRUE; ComponentLink1Description: Manufacturer URL
SW0 = CMP-1696-00002-1: Slide Switch, 500 V, -20 to 70 degC, 3-Pin THD, RoHS; Case\Package: SOT-23-5; Output Current: 150 mA; Nominal Output Voltage: 3.3 V; Max Power Dissipation: 250 mW; Min Input Voltage: 4.3 V; Outputs: 1; Max Input Voltage: 8 V; Dropout Voltage: 300 mV; PackageDescription: 3-Pin Through Hole Device, Body 11.6 x 4 mm, Pitch 2.5 mm; ComponentLink1URL: http://www.e-switch.ch/en/; RoHSCompliant: true; Length: 3 mm; ComponentLink1Description: Manufacturer URL; Power Rating: 250 mW; Mount: Surface Mount; Max Operating Temperature: 85 degC; REACH SVHC: No SVHC; Radiation Hardening: No; Height: 1.3 mm; Pins: 5; Max Ouput Current: 150 mA; Output Voltage: 3.3 V; Width: 1.8 mm; Package Quantity: 3000; ComponentLink2URL: https://www.e-switch.com/system/asset/product_line/data_sheet/119/EG.pdf; Min Operating Temperature: -40 degC; ComponentLink2Description: Datasheet; DatasheetVersion: Oct-15; PackageReference: EG1218; Packaging: Tape and Reel
SW1_RST SW_BT0 SW_BT1 = CMP-2000-07501-1: FSMSM Push Button Switch, 50 mA, -35 to 85 degC, 2-Pin SMD, RoHS, Tape and Reel; Manufacturer: TE Connectivity; Voltage Rating (DC): 24V; Electrical Life: 20000Cycles; Operating Force: 180gf; Switch Travel: 0.25mm; Contact Current Rating: 50mA; Case\/Package: SMD/SMT; Actuator Length: 1.07mm; Throw Configuration: SPST; Actuator Material: Polyamide; Contact Resistance: 100mOhm; Illumination Type: Illuminated; Max Voltage Rating (DC): 12V; Manufacturer URL: http://www.te.com/; Lead Free: LeadFree; Packaging: TapeandReel; Min Operating Temperature: -35degC; Mechanical Life: 20000Cycles; Mount: SurfaceMount; REACH SVHC: Unknown; Package Quantity: 1800; Package Reference: FSMSMTR; RoHSCompliant: true; Max Operating Temperature: 85degC; Orientation: Straight; ELV: Compliant; Datasheet URL: http://www.te.com/commerce/DocumentDelivery/DDEController?Action=showdoc&DocId=Customer+Drawing%7F1437566-3%7FC2%7Fpdf%7FEnglish%7FENG_CD_1437566-3_C2_1437566_3_1_c.dwg.pdf%7F1437566-4; Package Description: 2-Pin Surface Mount Device, Body 6 x 3.5 mm, Pitch 9.19 mm; Current Rating: 50mA; Contact Plating: Silver; Termination: GullWing; Datasheet Version: Rev. C2, 08/2014; Contact Material: Brass; Mounting Technology: SurfaceMount
U2 U6 = CMP-0062-01631-4: 800mA Low-Dropout Linear Regulator, 4-pin SOT-223, Pb-Free; Manufacturer: Texas Instruments; PackageTopMarking: XYTT*N05B; PowerWise: N; High-Reliability: Y; CompType: LDO IC; Code_IPC: SOT223-4; PackageReference: DCY0004A; PinCount: 4; PackageDescription: Molded SOT-223, 6.50 x 3.56 x 1.6mm Body, 4 Lead, 2.3mm Pitch; PartNumber: LM1117IMP-3.3/NOPB; RoHS: Y; ComponentLink1Description: Datasheet URL; Code_JEDEC: TO-261-AA; ComponentLink1URL: http://www.ti.com/general/docs/lit/getliterature.tsp?genericPartNumber=LM1117-N&fileType=pdf
U3 = MP2307DN-LF-Z: Buck Switching Regulator IC Positive Adjustable 0.925V 1 Output 3A 8-SOIC (0.154, 3.90mm Width) Exposed Pad; MF: Monolithic Power; Check_prices: https://www.snapeda.com/parts/MP2307DN-LF-Z/Monolithic+Power+Systems+Inc./view-part/?ref=eda; SnapEDA_Link: https://www.snapeda.com/parts/MP2307DN-LF-Z/Monolithic+Power+Systems+Inc./view-part/?ref=snap; Availability: In Stock; Value: *; Price: None; MP: MP2307DN-LF-Z; Package: SOIC-8 Monolithic Power; Purchase-URL: https://pricing.snapeda.com/search/part/MP2307DN-LF-Z/?ref=eda
U4 = CMP-0234-00071-2: MEMS motion sensor: ultra-stable three-axis digital output gyroscope, -40 to +85°C, LGA-16 (4x4x1.1), Tray; ComponentLink2URL: http://www.st.com/internet/analog/product/250373.jsp; ComponentLink1Description: L3G4200D Datasheet; DatasheetVersion: rev3, Dec-2010; ComponentLink3URL: http://www.st.com/internet/com/home/home.jsp; PackageVersion: 2010; PackageReference: LGA16-4X4X1.1; PackageDescription: 16-Pin Land Grid Array Package, 4 x 4 x 1.1 mm Body, 0.65 mm Pitch; ComponentLink2Description: L3G4200D Web Page; ComponentLink3Description: st.com Home; ComponentLink1URL: http://www.st.com/internet/com/TECHNICAL_RESOURCES/TECHNICAL_LITERATURE/DATASHEET/CD00265057.pdf
U5 = CMP-1529-00004-3: IC MOTOR DRIVER PAR 16HTSSOP; Supply Current: 3mA; Max Output Current: 2A; Interface: PWM; Output Current: 1.5A; Max Supply Voltage: 10.8V; Fault Protection: Over Temperature; Number of Outputs: 2; Min Supply Voltage: 2.7V; Nominal Supply Current: 3mA; Series: DRV8833; Min Operating Temperature: -40°C; Package Quantity: 2000; Packaging: Tape and Reel; Case/Package: HTSSOP; Output Current per Channel: 1.5A; RoHS Compliant: Yes; RMS Current (Irms): 1.5A; Max Operating Temperature: 85°C; Technology: NMOS; Number of Pins: 16; Radiation Hardening: No; Lead Free: Lead Free; REACH SVHC: No SVHC
U? = CMP-031-00006-1: ARMÂ® CortexÂ®-M4 STM32F4 Microcontroller IC 32-Bit Single-Core 168MHz 1MB (1M x 8) FLASH 64-LQFP (10x10); MF: STMicroelectronics; Check_prices: https://www.snapeda.com/parts/STM32F405RGT6/STMicroelectronics/view-part/?ref=eda; Design Item ID: STM32F405RGT6; MP: STM32F405RGT6; Source: STM32F405RGT6.SchLib; Component Type: Standard; Value: *; SnapEDA_Link: https://www.snapeda.com/parts/STM32F405RGT6/STMicroelectronics/view-part/?ref=snap; Pins: 64; Case/Package: LQFP-64 STMicroelectronics
U_enA U_enB = MT6701CT-STD: Manufacturer: MagnTek(麦歌恩); Add into BOM: yes; Symbol: MT6701CT-STD; Device: MT6701CT-STD; LCSC Part Name: 霍尔在线编程角度位置传感器; Supplier Part: C2856764; Manufacturer Part: MT6701CT-STD; Supplier Footprint: SOP-8; JLCPCB Part Class: Extended Part; Datasheet: https://item.szlcsc.com/datasheet/MT6701CT-STD/3056853.html; Supplier: LCSC; Convert to PCB: yes
Y1 = CMP-27762-009874-1: CRYSTAL 8.0000MHZ 18PF SMD; ESR (Equivalent Series Resistance): 80R; Operating Frequency: 8 MHz; Frequency Stability: 50ppm; Tolerance: 20ppm; Frequency: 8MHz; Min Operating Temperature: -20°C; Lead Free: Lead Free; Width: 4.7mm; Packaging: Tape and Reel; Series: ABLS; Accuracy: 20ppm; Length: 11.4mm; Frequency Tolerance: 20ppm; Termination: SMD/SMT; Number of Pins: 2; Radiation Hardening: No; Depth: 4.7mm; REACH SVHC: No SVHC; Contact Plating: Tin; Load Capacitance: 18pF; Case/Package: SMD/SMT; Mount: Surface Mount; Package Quantity: 1000; Max Operating Temperature: 70°C; Height: 0.165inch; Series Resistance: 80R